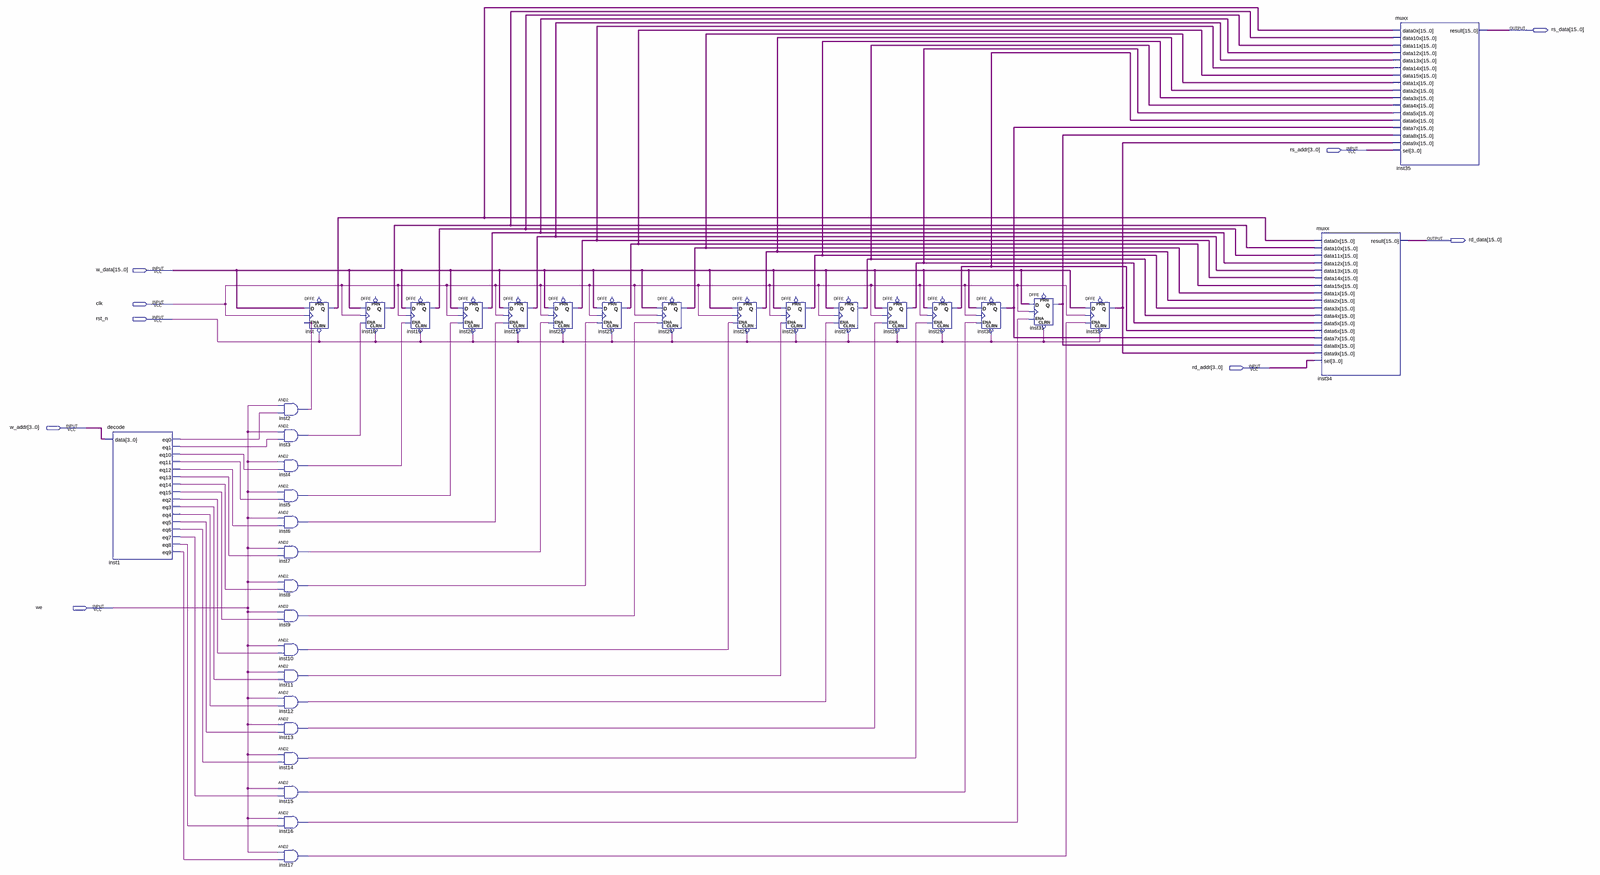
[diagram p0: schematic sheet, whole]
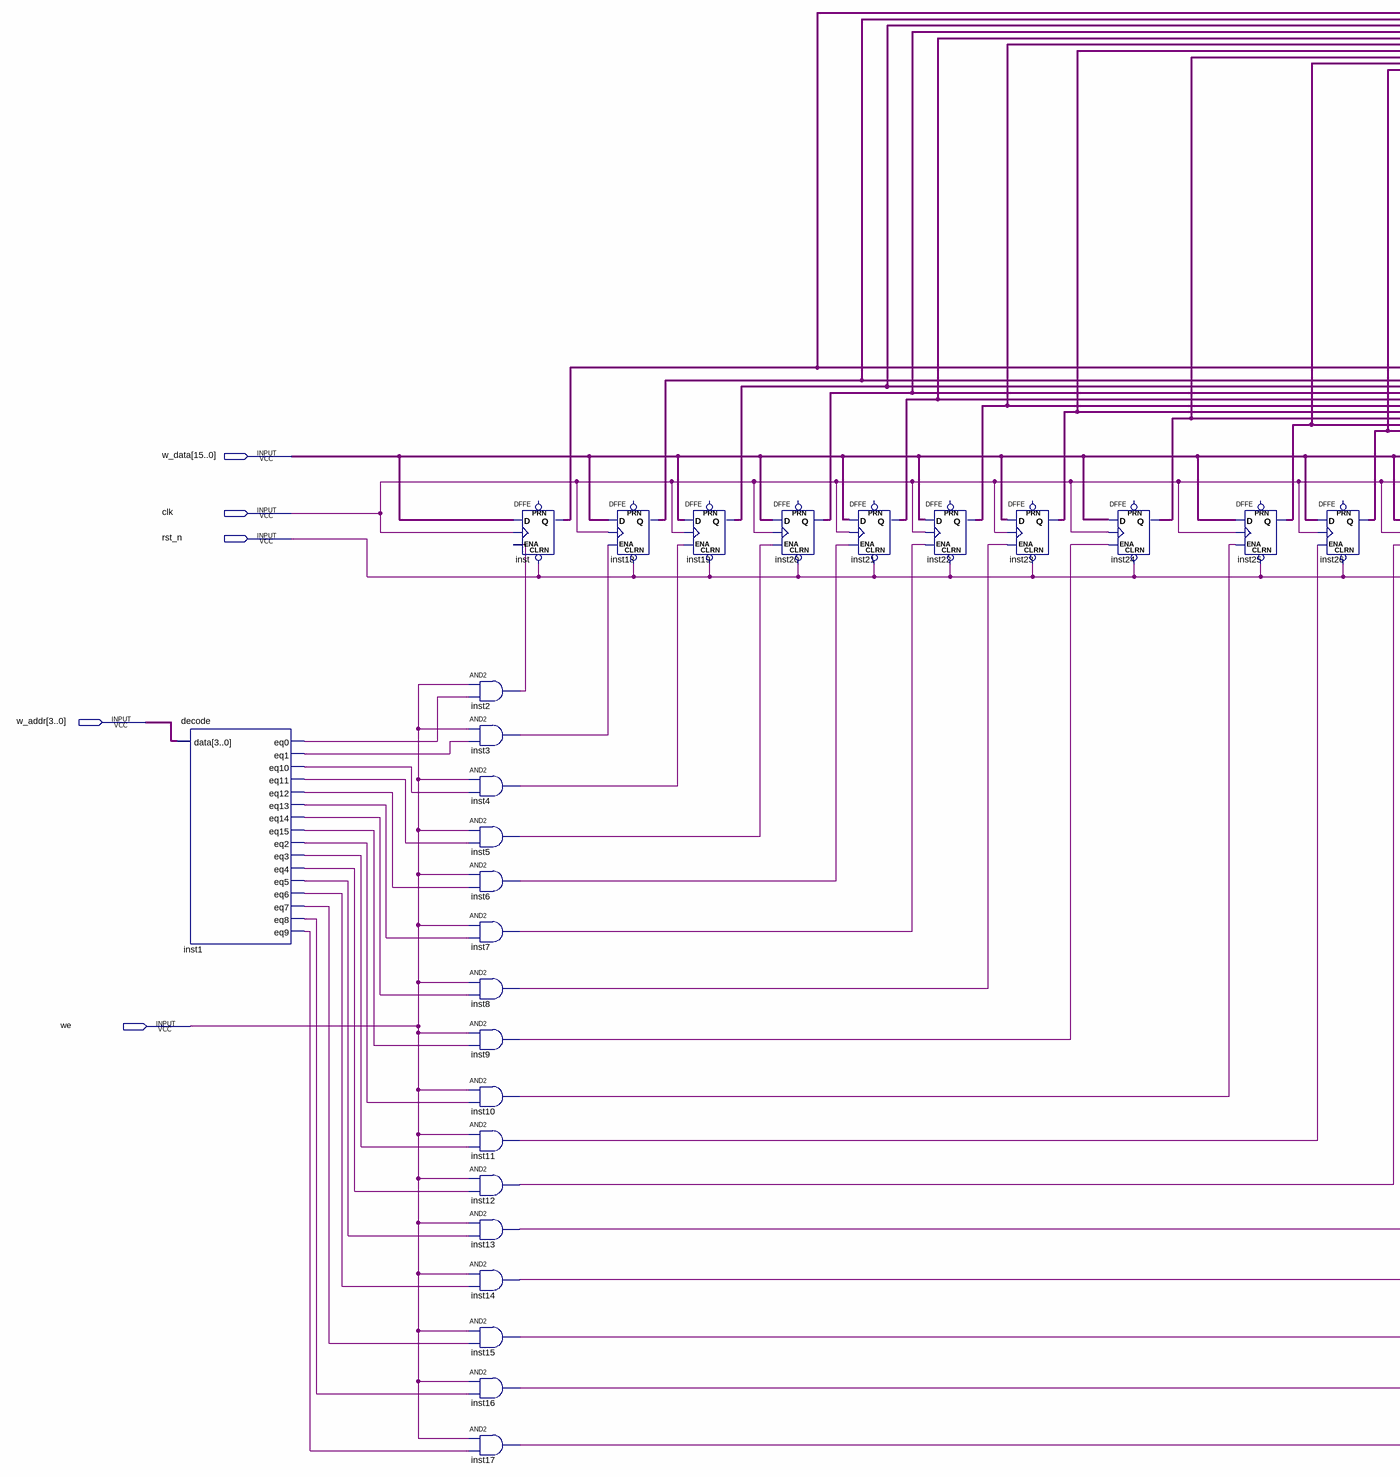
[diagram p1: schematic sheet, left part]
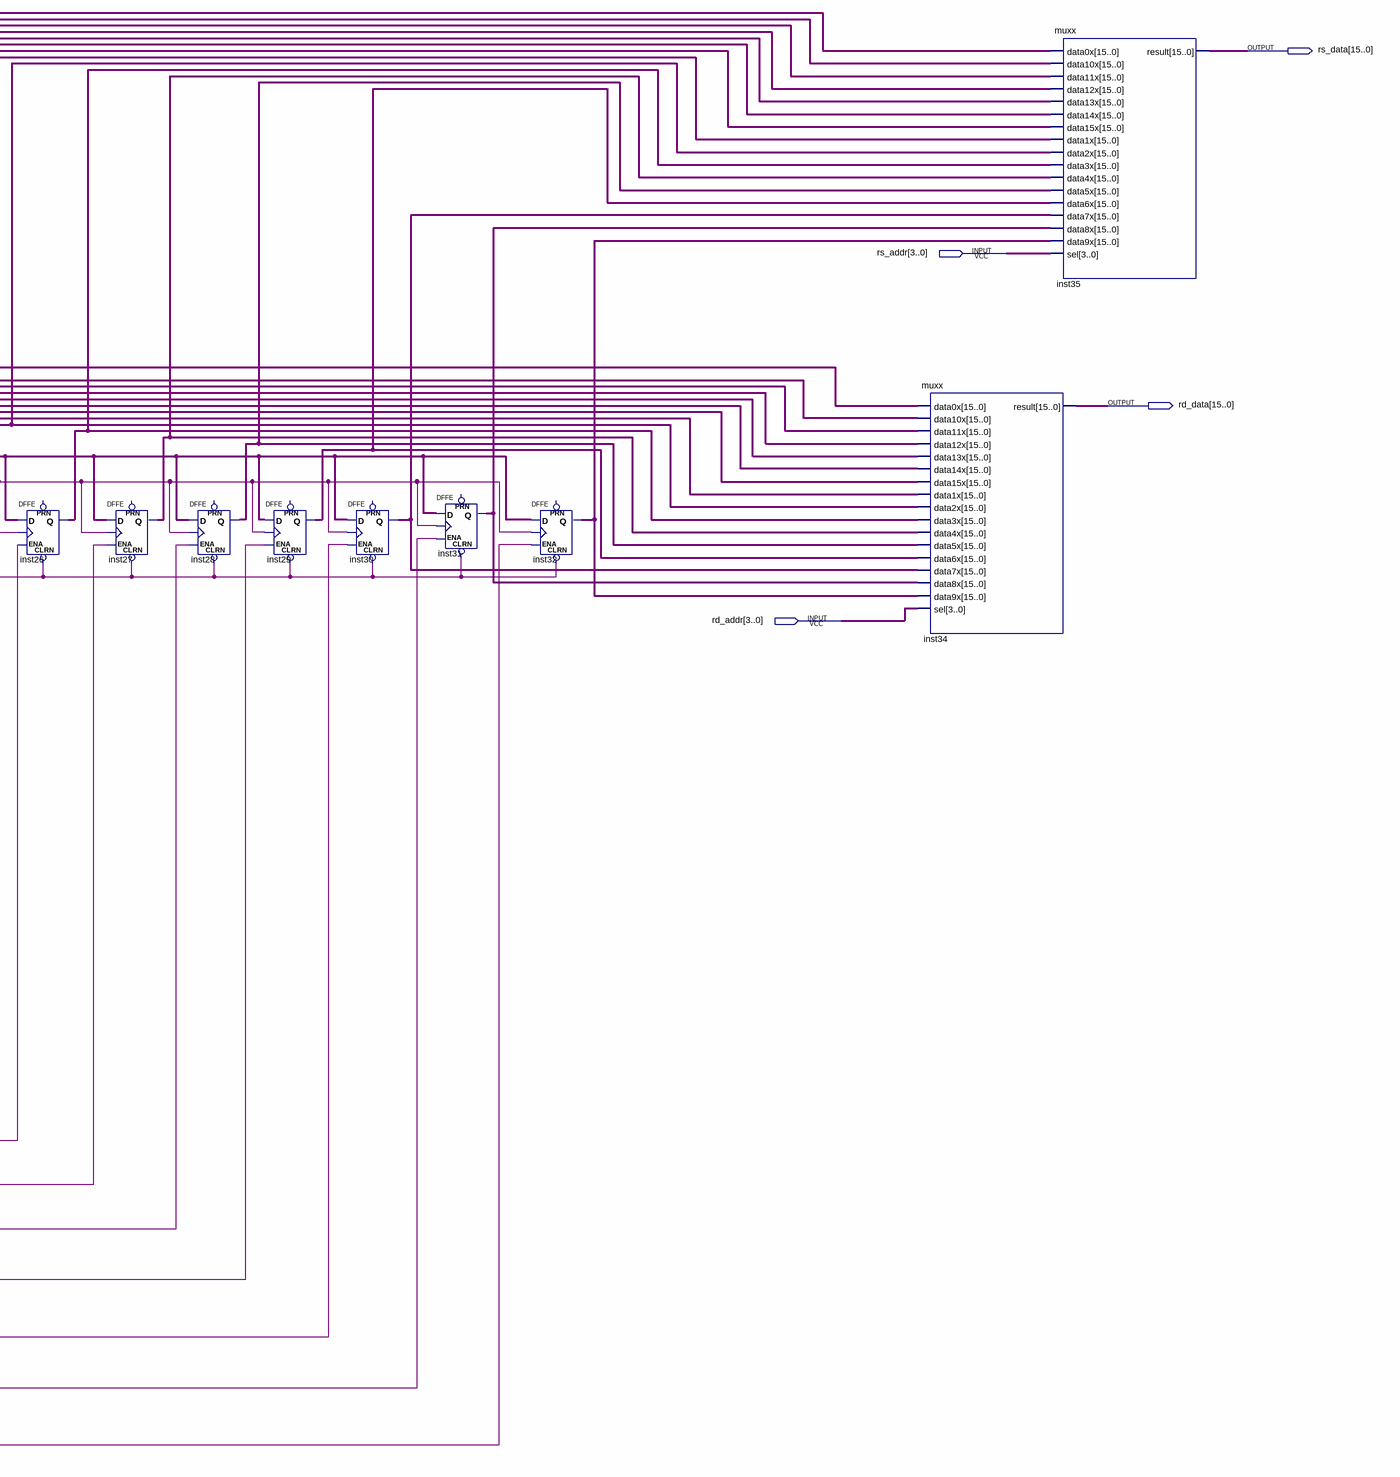
[diagram p2: schematic sheet, right part]
// Quartus schematic regfile.bdf as structural Verilog: 35 symbols, 9 pins
module regfile (
  input  [3:0] rs_addr,
  input  [15:0] w_data,
  input  clk,
  input  rst_n,
  input  [3:0] rd_addr,
  input  [3:0] w_addr,
  input  we,
  output [15:0] rs_data,
  output [15:0] rd_data
);

  wire inst1_eq0, inst1_eq1, inst1_eq2, inst1_eq3, inst1_eq4, inst1_eq5, inst1_eq6, inst1_eq7, inst1_eq8,
       inst1_eq9, inst1_eq10, inst1_eq11, inst1_eq12, inst1_eq13, inst1_eq14, inst1_eq15, inst2_out,
       inst3_out, inst4_out, inst5_out, inst6_out, inst7_out, inst8_out, inst9_out, inst10_out, inst11_out,
       inst12_out, inst13_out, inst14_out, inst15_out, inst16_out, inst17_out;
  wire [15:0] inst18_q, inst19_q, inst20_q, inst21_q, inst22_q, inst23_q, inst24_q, inst25_q, inst26_q,
       inst27_q, inst28_q, inst29_q, inst30_q, inst31_q, inst32_q, inst_q;

  decode inst1 (
    .data(w_addr), .eq0(inst1_eq0), .eq1(inst1_eq1), .eq10(inst1_eq10), .eq11(inst1_eq11), .eq12(inst1_eq12),
    .eq13(inst1_eq13), .eq14(inst1_eq14), .eq15(inst1_eq15), .eq2(inst1_eq2), .eq3(inst1_eq3),
    .eq4(inst1_eq4), .eq5(inst1_eq5), .eq6(inst1_eq6), .eq7(inst1_eq7), .eq8(inst1_eq8), .eq9(inst1_eq9));
  and inst2 (inst2_out, we, inst1_eq0);
  and inst3 (inst3_out, we, inst1_eq1);
  and inst4 (inst4_out, we, inst1_eq10);
  and inst5 (inst5_out, we, inst1_eq11);
  and inst6 (inst6_out, we, inst1_eq12);
  and inst7 (inst7_out, we, inst1_eq13);
  and inst8 (inst8_out, we, inst1_eq14);
  and inst9 (inst9_out, we, inst1_eq15);
  and inst10 (inst10_out, we, inst1_eq2);
  and inst11 (inst11_out, we, inst1_eq3);
  and inst12 (inst12_out, we, inst1_eq4);
  and inst13 (inst13_out, we, inst1_eq5);
  and inst14 (inst14_out, we, inst1_eq6);
  and inst15 (inst15_out, we, inst1_eq7);
  and inst16 (inst16_out, we, inst1_eq8);
  and inst17 (inst17_out, we, inst1_eq9);
  DFFE inst[15:0] (.CLRN(rst_n), .D(w_data), .CLK(clk), .ENA(inst2_out), .Q(inst_q));  // open: PRN
  DFFE inst18[15:0] (.CLRN(rst_n), .D(w_data), .CLK(clk), .ENA(inst3_out), .Q(inst18_q));  // open: PRN
  DFFE inst19[15:0] (.CLRN(rst_n), .D(w_data), .CLK(clk), .ENA(inst4_out), .Q(inst19_q));  // open: PRN
  DFFE inst20[15:0] (.CLRN(rst_n), .D(w_data), .CLK(clk), .ENA(inst5_out), .Q(inst20_q));  // open: PRN
  DFFE inst21[15:0] (.CLRN(rst_n), .D(w_data), .CLK(clk), .ENA(inst6_out), .Q(inst21_q));  // open: PRN
  DFFE inst22[15:0] (.CLRN(rst_n), .D(w_data), .CLK(clk), .ENA(inst7_out), .Q(inst22_q));  // open: PRN
  DFFE inst23[15:0] (.CLRN(rst_n), .D(w_data), .CLK(clk), .ENA(inst8_out), .Q(inst23_q));  // open: PRN
  DFFE inst24[15:0] (.CLRN(rst_n), .D(w_data), .CLK(clk), .ENA(inst9_out), .Q(inst24_q));  // open: PRN
  DFFE inst25[15:0] (.CLRN(rst_n), .D(w_data), .CLK(clk), .ENA(inst10_out), .Q(inst25_q));  // open: PRN
  DFFE inst26[15:0] (.CLRN(rst_n), .D(w_data), .CLK(clk), .ENA(inst11_out), .Q(inst26_q));  // open: PRN
  DFFE inst27[15:0] (.CLRN(rst_n), .D(w_data), .CLK(clk), .ENA(inst12_out), .Q(inst27_q));  // open: PRN
  DFFE inst28[15:0] (.CLRN(rst_n), .D(w_data), .CLK(clk), .ENA(inst13_out), .Q(inst28_q));  // open: PRN
  DFFE inst29[15:0] (.CLRN(rst_n), .D(w_data), .CLK(clk), .ENA(inst14_out), .Q(inst29_q));  // open: PRN
  DFFE inst30[15:0] (.CLRN(rst_n), .D(w_data), .CLK(clk), .ENA(inst15_out), .Q(inst30_q));  // open: PRN
  DFFE inst31[15:0] (.CLRN(rst_n), .D(w_data), .CLK(clk), .ENA(inst16_out), .Q(inst31_q));  // open: PRN
  DFFE inst32[15:0] (.CLRN(rst_n), .D(w_data), .CLK(clk), .ENA(inst17_out), .Q(inst32_q));  // open: PRN
  muxx inst34 (
    .data0x(inst_q), .data10x(inst18_q), .data11x(inst19_q), .data12x(inst20_q), .data13x(inst21_q),
    .data14x(inst22_q), .data15x(inst23_q), .data1x(inst24_q), .data2x(inst25_q), .data3x(inst26_q),
    .data4x(inst27_q), .data5x(inst28_q), .data6x(inst29_q), .data7x(inst30_q), .data8x(inst31_q),
    .data9x(inst32_q), .sel(rd_addr), .result(rd_data));
  muxx inst35 (
    .data0x(inst_q), .data10x(inst18_q), .data11x(inst19_q), .data12x(inst20_q), .data13x(inst21_q),
    .data14x(inst22_q), .data15x(inst23_q), .data1x(inst24_q), .data2x(inst25_q), .data3x(inst26_q),
    .data4x(inst27_q), .data5x(inst28_q), .data6x(inst29_q), .data7x(inst30_q), .data8x(inst31_q),
    .data9x(inst32_q), .sel(rs_addr), .result(rs_data));
endmodule
